# EAGLE design hybrid_lower_pcb3 (EAGLE 8.4.1)

## Sheet 1 of 8: micro,xbee,sd
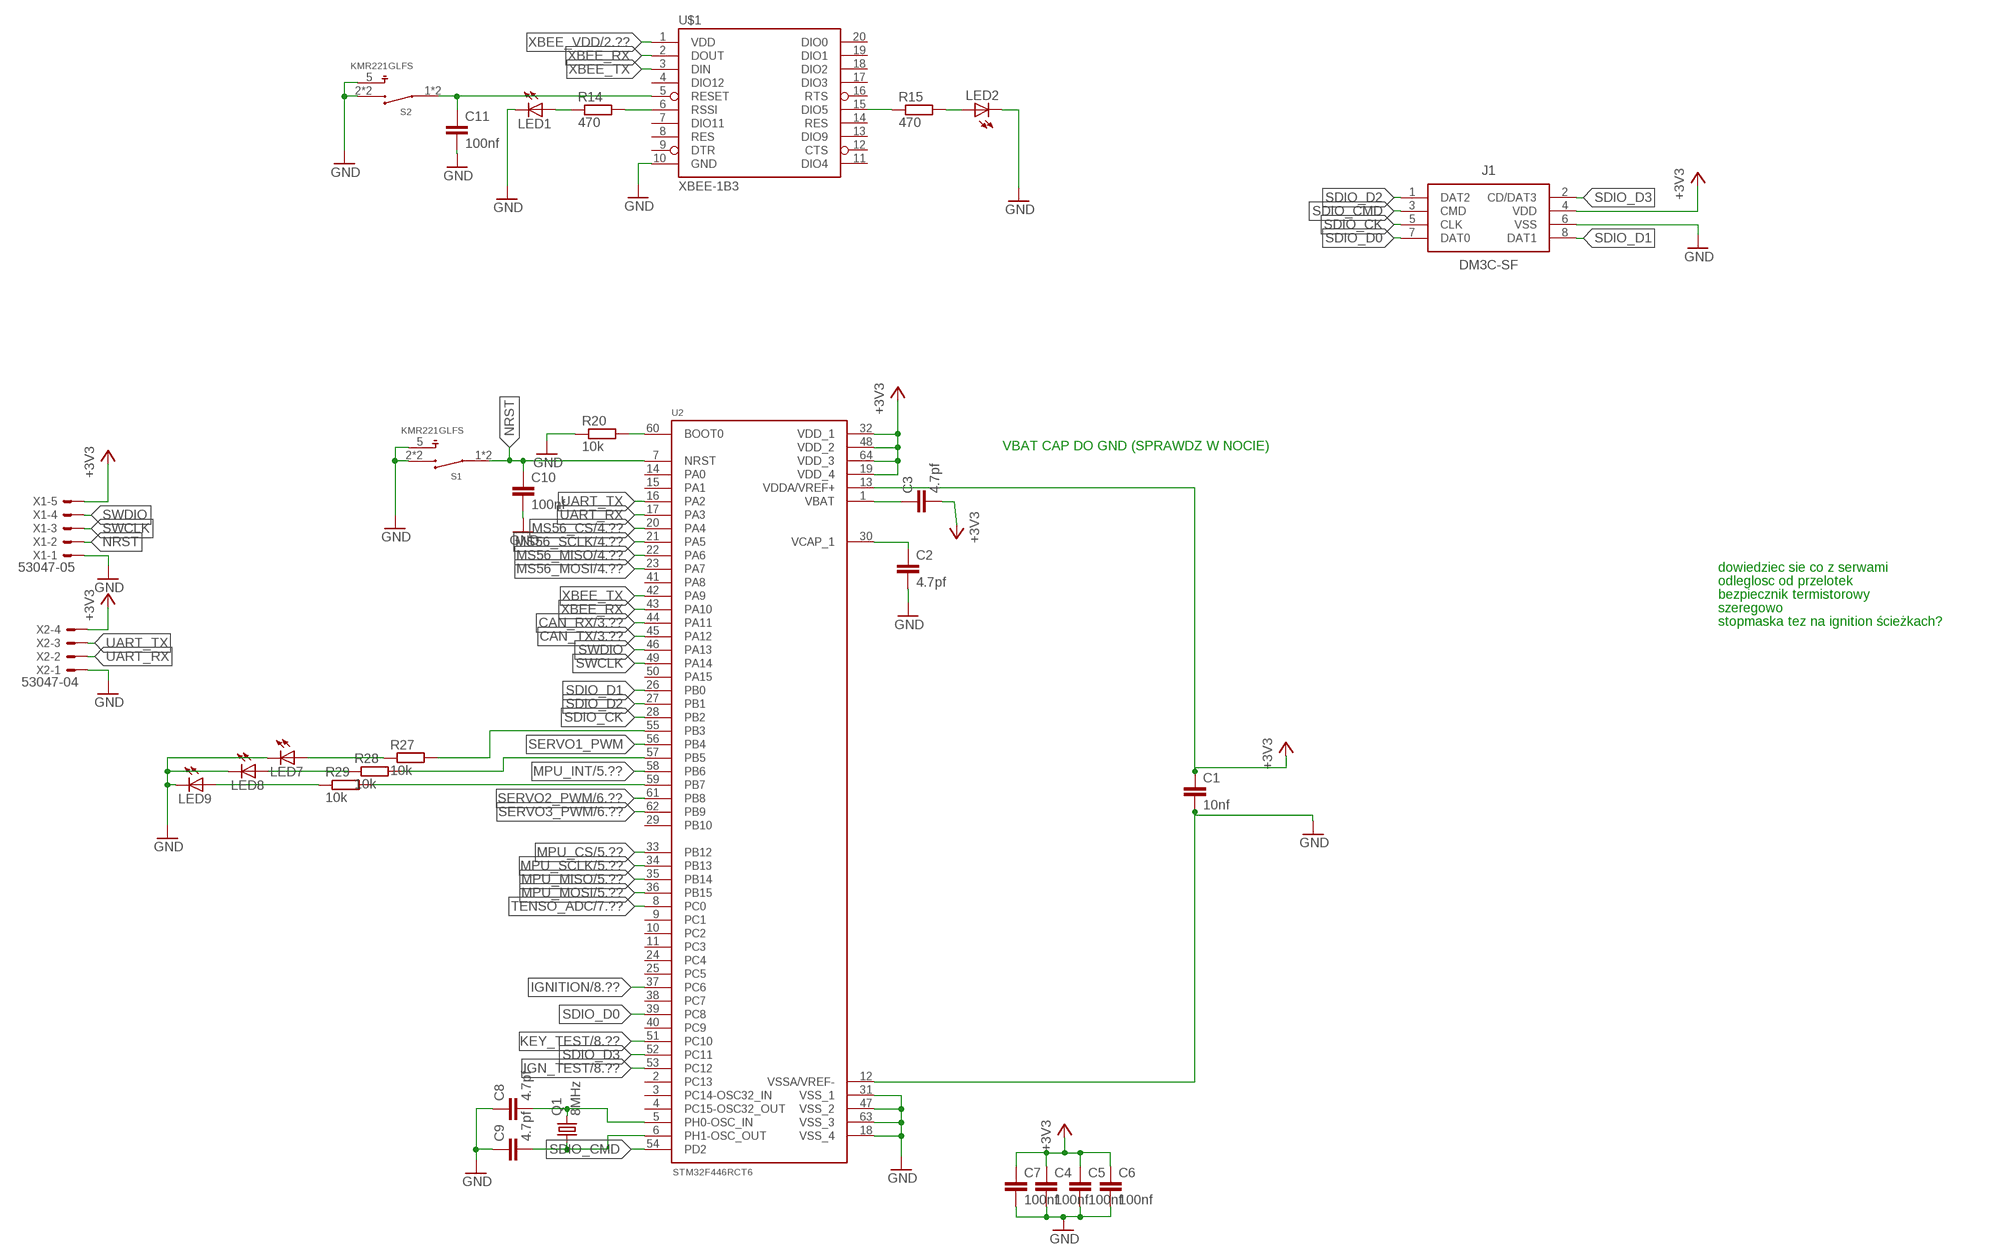
[diagram p0: schematic, sheet 1]

### Parts
C1  10nf  C-EUC0603  [C0603]
C2  4.7pf  C-EUC0603  [C0603]
C3  4.7pf  C-EUC0603  [C0603]
C4  100nf  C-EUC0603  [C0603]
C5  100nf  C-EUC0603  [C0603]
C6  100nf  C-EUC0603  [C0603]
C7  100nf  C-EUC0603  [C0603]
C8  4.7pf  C-EUC0603  [C0603]
C9  4.7pf  C-EUC0603  [C0603]
C10  100nf  C-EUC0603  [C0603]
C11  100nf  C-EUC0603  [C0603]
J1  DM3C-SF  [DM3C-SF]
LED1  LED0603  [LED-0603]
LED2  LED0603  [LED-0603]
LED7  LED0603  [LED-0603]
LED8  LED0603  [LED-0603]
LED9  LED0603  [LED-0603]
Q1  8MHz  CRYSTALCTS406  [CTS406]
R14  470  R-EU_R0603  [R0603]
R15  470  R-EU_R0603  [R0603]
R20  10k  R-EU_R0603  [R0603]
R27  10k  R-EU_R0603  [R0603]
R28  10k  R-EU_R0603  [R0603]
R29  10k  R-EU_R0603  [R0603]
S1  KMR221GLFS  [SW_KMR221GLFS]
S2  KMR221GLFS  [SW_KMR221GLFS]
U2  STM32F446RCT6  [QFP50P1200X1200X160-64N]
U$1  XBEE-1B3  [XBEE-SMD]
X1  53047-05  [53047-05]
X2  53047-04  [53047-04]

### Nets
+3V3: C1.1 C3.2 C4.1 C5.1 C6.1 C7.1 J1.4(VDD) U2.13(VDDA/VREF+) U2.19(VDD_4) U2.32(VDD_1) U2.48(VDD_2) U2.64(VDD_3) X1.5 X2.4 ; also sheet 2,3,4,5,8
CAN_RX: U2.44(PA11) ; also sheet 3
CAN_TX: U2.45(PA12) ; also sheet 3
DUPA: C11.1 S2.1 S2.4 U$1.5(RESET)
GND: C1.2 C2.2 C4.2 C5.2 C6.2 C7.2 C8.1 C9.1 C10.2 C11.2 J1.6(VSS) LED1.C LED2.C LED7.C LED8.C LED9.C R20.1 S1.2 S1.3 S1.5 S2.2 S2.3 S2.5 U2.12(VSSA/VREF-) U2.18(VSS_4) U2.31(VSS_1) U2.47(VSS_2) U2.63(VSS_3) U$1.10(GND) X1.1 X2.1 ; also sheet 2,3,4,5,6,7,8
IGN_TEST: U2.53(PC12) ; also sheet 8
IGNITION: U2.37(PC6) ; also sheet 8
KEY_TEST: U2.51(PC10) ; also sheet 8
MPU_CS: U2.33(PB12) ; also sheet 5
MPU_INT: U2.58(PB6) ; also sheet 5
MPU_MISO: U2.35(PB14) ; also sheet 5
MPU_MOSI: U2.36(PB15) ; also sheet 5
MPU_SCLK: U2.34(PB13) ; also sheet 5
MS56_CS: U2.20(PA4) ; also sheet 4
MS56_MISO: U2.22(PA6) ; also sheet 4
MS56_MOSI: U2.23(PA7) ; also sheet 4
MS56_SCLK: U2.21(PA5) ; also sheet 4
N$2: C2.1 U2.30(VCAP_1)
N$6: C3.1 U2.1(VBAT)
N$7: LED1.A R14.1
N$8: C8.2 Q1.3 U2.5(PH0-OSC_IN)
N$9: C9.2 Q1.1 U2.6(PH1-OSC_OUT)
N$11: LED2.A R15.2
N$18: R14.2 U$1.6(RSSI)
N$19: R15.1 U$1.15(DIO5)
N$29: R20.2 U2.60(BOOT0)
N$30: R27.2 U2.55(PB3)
N$33: R28.2 U2.57(PB5)
N$34: R29.2 U2.59(PB7)
N$36: LED7.A R27.1
N$37: LED8.A R28.1
N$38: LED9.A R29.1
NRST: C10.1 S1.1 S1.4 U2.7(NRST) X1.2
SDIO_CK: J1.5(CLK) U2.28(PB2)
SDIO_CMD: J1.3(CMD) U2.54(PD2)
SDIO_D0: J1.7(DAT0) U2.39(PC8)
SDIO_D1: J1.8(DAT1) U2.26(PB0)
SDIO_D2: J1.1(DAT2) U2.27(PB1)
SDIO_D3: J1.2(CD/DAT3) U2.52(PC11)
SERVO1_PWM: U2.56(PB4)
SERVO2_PWM: U2.61(PB8) ; also sheet 6
SERVO3_PWM: U2.62(PB9) ; also sheet 6
SWCLK: U2.49(PA14) X1.3
SWDIO: U2.46(PA13) X1.4
TENSO_ADC: U2.8(PC0) ; also sheet 7
UART_RX: U2.17(PA3) X2.2
UART_TX: U2.16(PA2) X2.3
XBEE_RX: U2.43(PA10) U$1.2(DOUT)
XBEE_TX: U2.42(PA9) U$1.3(DIN)
XBEE_VDD: U$1.1(VDD) ; also sheet 2
Unconnected: U2.2(PC13) U2.3(PC14-OSC32_IN) U2.4(PC15-OSC32_OUT) U2.9(PC1) U2.10(PC2) U2.11(PC3) U2.14(PA0) U2.15(PA1) U2.24(PC4) U2.25(PC5) U2.29(PB10) U2.38(PC7) U2.40(PC9) U2.41(PA8) U2.50(PA15) U$1.4(DIO12) U$1.7(DIO11) U$1.8(RES) U$1.9(DTR) U$1.11(DIO4) U$1.12(CTS) U$1.13(DIO9) U$1.14(RES) U$1.16(RTS) U$1.17(DIO3) U$1.18(DIO2) U$1.19(DIO1) U$1.20(DIO0)

### Notes on the sheet
- VBAT CAP DO GND (SPRAWDZ W NOCIE)
- dowiedziec sie co z serwami
- odleglosc od przelotek
- bezpiecznik termistorowy
- szeregowo
- stopmaska tez na ignition ścieżkach?

## Sheet 2 of 8: supply
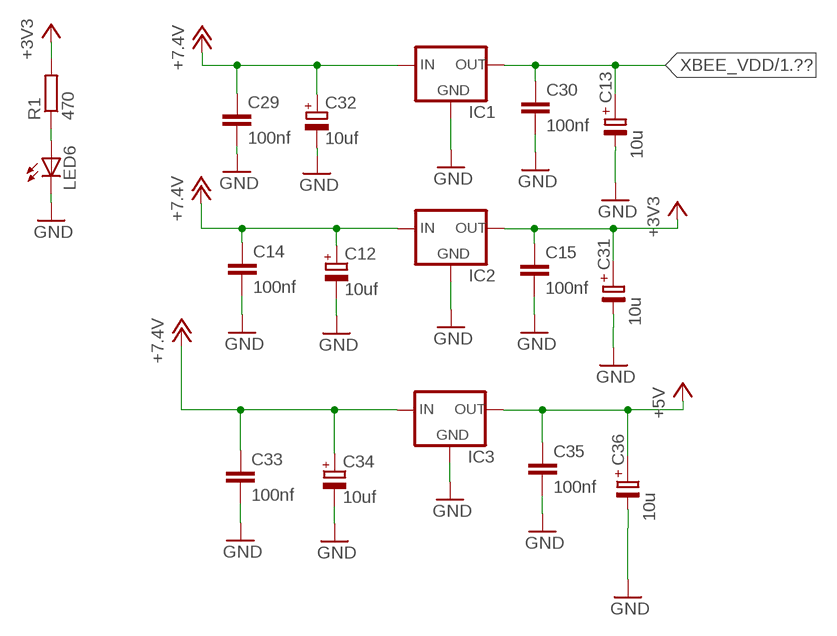
[diagram p1: schematic, sheet 2]

### Parts
C12  10uf  CPOL-EUSANYO_SMD_B6  [SANYO-OSCON_SMD_B6]
C13  10u  C-PR-SMD-TE-B  [TE-B-3528]
C14  100nf  C-EUC0603  [C0603]
C15  100nf  C-EUC0603  [C0603]
C29  100nf  C-EUC0603  [C0603]
C30  100nf  C-EUC0603  [C0603]
C31  10u  C-PR-SMD-TE-B  [TE-B-3528]
C32  10uf  CPOL-EUSANYO_SMD_B6  [SANYO-OSCON_SMD_B6]
C33  100nf  C-EUC0603  [C0603]
C34  10uf  CPOL-EUSANYO_SMD_B6  [SANYO-OSCON_SMD_B6]
C35  100nf  C-EUC0603  [C0603]
C36  10u  C-PR-SMD-TE-B  [TE-B-3528]
IC1  LM1117  [SOT223]
IC2  LM1117  [SOT223]
IC3  LM1117  [SOT223]
LED6  LED0603  [LED-0603]
R1  470  R-EU_R0603  [R0603]

### Nets
+3V3: C15.1 C31.+ IC2.2(OUT) R1.2 ; also sheet 1,3,4,5,8
+5V: C35.1 C36.+ IC3.2(OUT) ; also sheet 6,7
+12V: C12.+ C14.1 C29.1 C32.+ C33.1 C34.+ IC1.3(IN) IC2.3(IN) IC3.3(IN) ; supply symbol labelled +7.4V ; also sheet 6,8
GND: C12.- C13.- C14.2 C15.2 C29.2 C30.2 C31.- C32.- C33.2 C34.- C35.2 C36.- IC1.1(GND) IC2.1(GND) IC3.1(GND) LED6.C ; also sheet 1,3,4,5,6,7,8
N$28: LED6.A R1.1
XBEE_VDD: C13.+ C30.1 IC1.2(OUT) ; also sheet 1

## Sheet 3 of 8: CAN
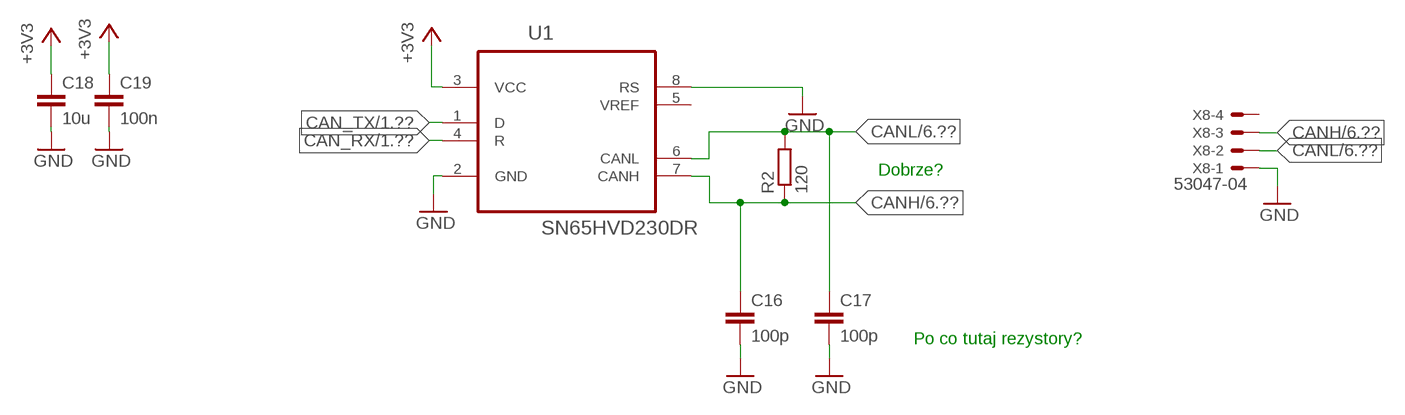
[diagram p2: schematic, sheet 3]

### Parts
C16  100p  C-EUC0603  [C0603]
C17  100p  C-EUC0603  [C0603]
C18  10u  C-EUC0603  [C0603]
C19  100n  C-EUC0603  [C0603]
R2  120  R-EU_R0603  [R0603]
U1  SN65HVD230DR  [SOIC127P600X175-8N]
X8  53047-04  [53047-04]

### Nets
+3V3: C18.1 C19.1 U1.3(VCC) ; also sheet 1,2,4,5,8
CAN_RX: U1.4(R) ; also sheet 1
CAN_TX: U1.1(D) ; also sheet 1
CANH: C16.1 R2.1 U1.7(CANH) X8.3 ; also sheet 6
CANL: C17.1 R2.2 U1.6(CANL) X8.2 ; also sheet 6
GND: C16.2 C17.2 C18.2 C19.2 U1.2(GND) U1.8(RS) X8.1 ; also sheet 1,2,4,5,6,7,8
Unconnected: U1.5(VREF) X8.4

### Notes on the sheet
- Dobrze?
- Po co tutaj rezystory?

## Sheet 4 of 8: Altimeter
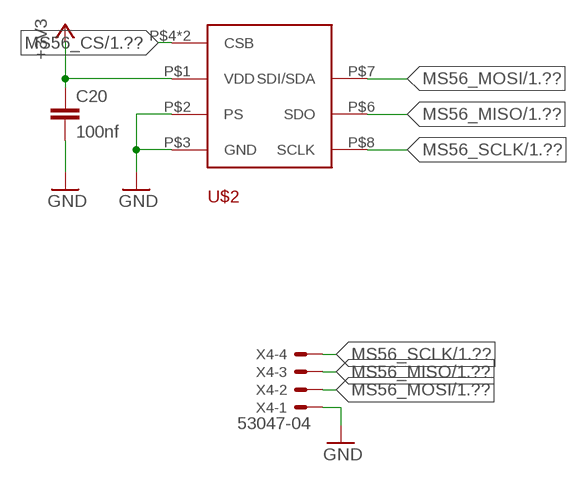
[diagram p3: schematic, sheet 4]

### Parts
C20  100nf  C-EUC0603  [C0603]
U$2  MS56XX  [MS56XX]
X4  53047-04  [53047-04]

### Nets
+3V3: C20.1 U$2.P$1(VDD) ; also sheet 1,2,3,5,8
GND: C20.2 U$2.P$2(PS) U$2.P$3(GND) X4.1 ; also sheet 1,2,3,5,6,7,8
MS56_CS: U$2.P$4(CSB) U$2.P$5(CSB) ; also sheet 1
MS56_MISO: U$2.P$6(SDO) X4.3 ; also sheet 1
MS56_MOSI: U$2.P$7(SDI/SDA) X4.2 ; also sheet 1
MS56_SCLK: U$2.P$8(SCLK) X4.4 ; also sheet 1

## Sheet 5 of 8: MPU-9250
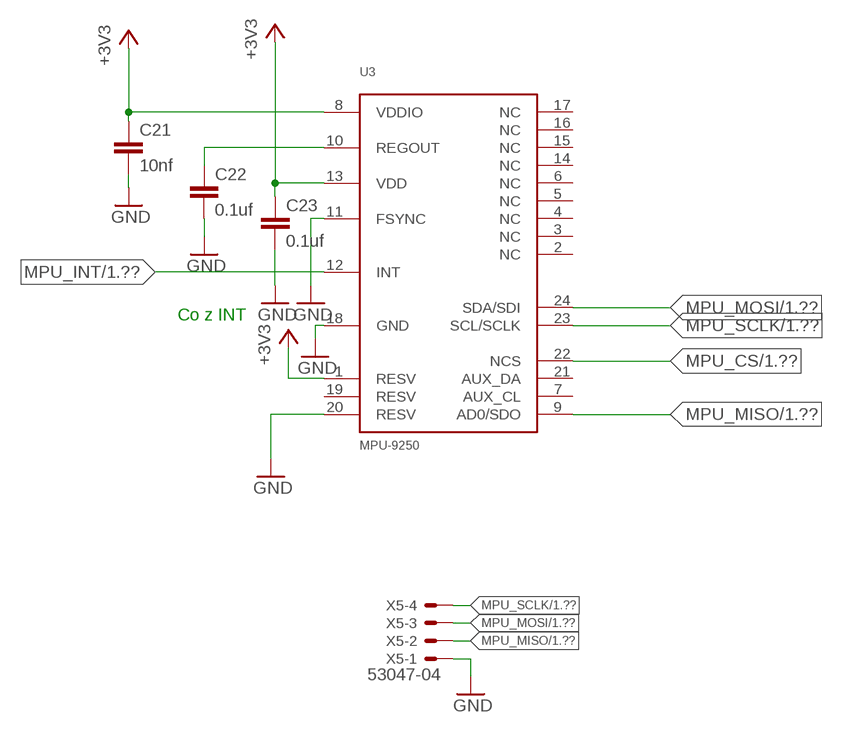
[diagram p4: schematic, sheet 5]

### Parts
C21  10nf  C-EUC0603  [C0603]
C22  0.1uf  C-EUC0603  [C0603]
C23  0.1uf  C-EUC0603  [C0603]
U3  MPU-9250  [MPU-9250]
X5  53047-04  [53047-04]

### Nets
+3V3: C21.1 C23.1 U3.1(RESV) U3.8(VDDIO) U3.13(VDD) ; also sheet 1,2,3,4,8
GND: C21.2 C22.2 C23.2 U3.11(FSYNC) U3.18(GND) U3.20(RESV) X5.1 ; also sheet 1,2,3,4,6,7,8
MPU_CS: U3.22(NCS) ; also sheet 1
MPU_INT: U3.12(INT) ; also sheet 1
MPU_MISO: U3.9(AD0/SDO) X5.2 ; also sheet 1
MPU_MOSI: U3.24(SDA/SDI) X5.3 ; also sheet 1
MPU_SCLK: U3.23(SCL/SCLK) X5.4 ; also sheet 1
N$1: C22.1 U3.10(REGOUT)
Unconnected: U3.2(NC) U3.3(NC) U3.4(NC) U3.5(NC) U3.6(NC) U3.7(AUX_CL) U3.14(NC) U3.15(NC) U3.16(NC) U3.17(NC) U3.19(RESV) U3.21(AUX_DA)

### Notes on the sheet
- Co z INT

## Sheet 6 of 8: connection
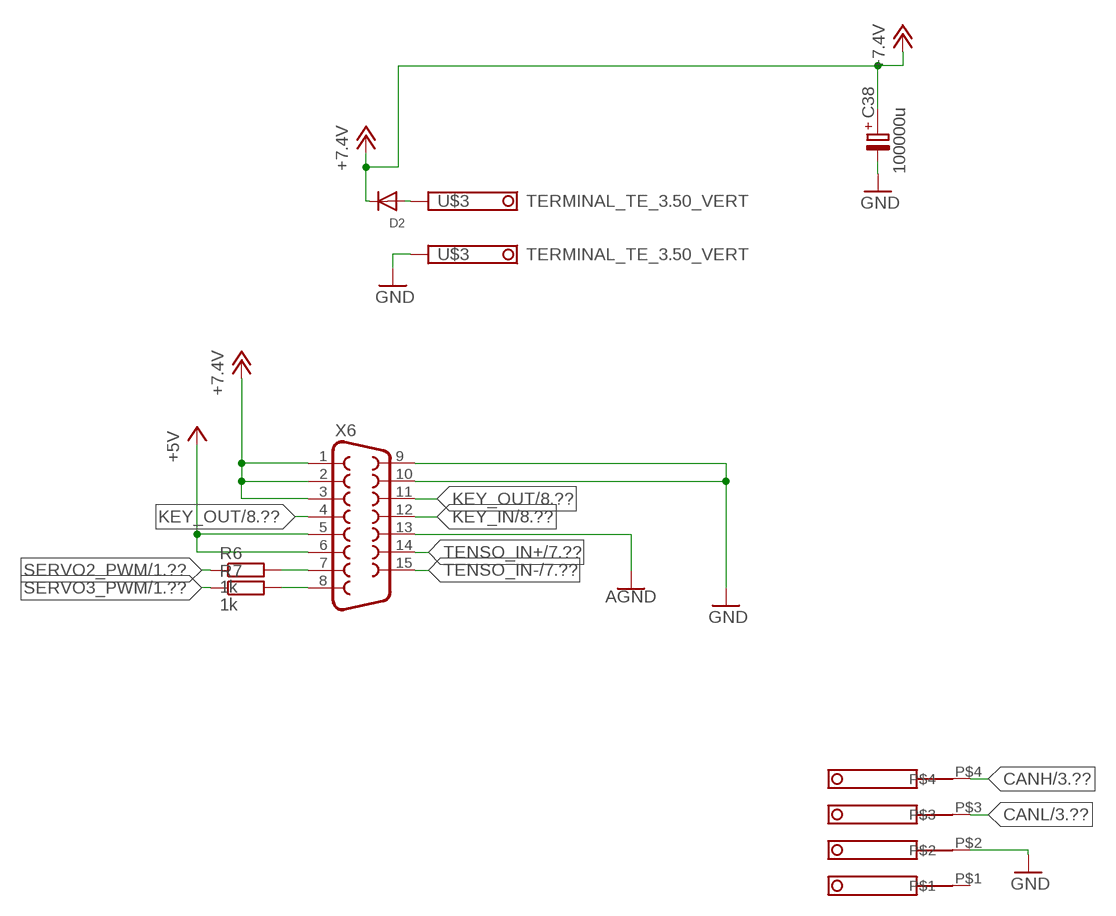
[diagram p5: schematic, sheet 6]

### Parts
C38  100000u  C-PR-SMD-TE-B  [TE-B-3528]
D2  DIODESOD-523  [SOD-523]
R6  1k  R-EU_R0603  [R0603]
R7  1k  R-EU_R0603  [R0603]
U$3  TERMINAL_TE_3.50_VERT  [TE_3.5_TERMINAL_VERT]
U$10  39505-1005  [39505-1005]
X6  F15VP  [F15VP]

### Nets
+5V: X6.5 X6.6 ; also sheet 2,7
+12V: C38.+ D2.K(C) X6.1 X6.2 X6.3 ; supply symbol labelled +7.4V ; also sheet 2,8
AGND: X6.13 ; also sheet 7
CANH: U$10.P$4 ; also sheet 3
CANL: U$10.P$3 ; also sheet 3
GND: C38.- U$3.P$2(K1) U$10.P$2 X6.9 X6.10 ; also sheet 1,2,3,4,5,7,8
KEY_IN: X6.12 ; also sheet 8
KEY_OUT: X6.4 X6.11 ; also sheet 8
N$13: R6.2 X6.7
N$14: R7.2 X6.8
N$17: D2.A U$3.P$1(K)
SERVO2_PWM: R6.1 ; also sheet 1
SERVO3_PWM: R7.1 ; also sheet 1
TENSO_IN+: X6.14 ; also sheet 7
TENSO_IN-: X6.15 ; also sheet 7
Unconnected: U$10.P$1

## Sheet 7 of 8
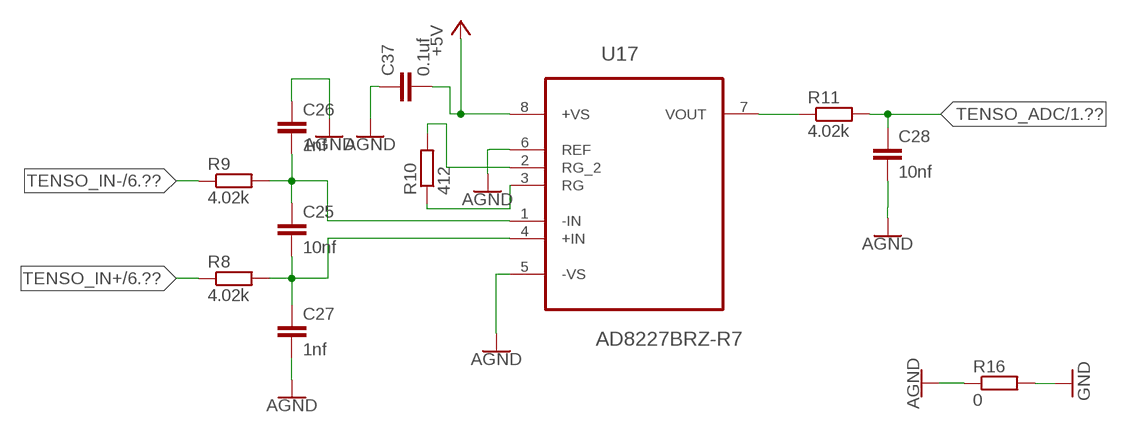
[diagram p6: schematic, sheet 7]

### Parts
C25  10nf  C-EUC0603  [C0603]
C26  1nf  C-EUC0603  [C0603]
C27  1nf  C-EUC0603  [C0603]
C28  10nf  C-EUC0603  [C0603]
C37  0.1uf  C-EUC0603  [C0603]
R8  4.02k  R-EU_R0603  [R0603]
R9  4.02k  R-EU_R0603  [R0603]
R10  412  R-EU_R0805  [R0805]
R11  4.02k  R-EU_R0603  [R0603]
R16  0  R-EU_R0603  [R0603]
U17  AD8227BRZ-R7  [SOIC127P600X175-8N]

### Nets
+5V: C37.2 U17.8(+VS) ; also sheet 2,6
AGND: C26.1 C27.2 C28.2 C37.1 R16.1 U17.5(-VS) U17.6(REF) ; also sheet 6
GND: R16.2 ; also sheet 1,2,3,4,5,6,8
N$3: C25.1 C26.2 R9.2 U17.1(-IN)
N$4: C25.2 C27.1 R8.2 U17.4(+IN)
N$10: R10.1 U17.3(RG)
N$15: R10.2 U17.2(RG_2)
N$16: R11.1 U17.7(VOUT)
TENSO_ADC: C28.1 R11.2 ; also sheet 1
TENSO_IN+: R8.1 ; also sheet 6
TENSO_IN-: R9.1 ; also sheet 6

## Sheet 8 of 8: Ignition
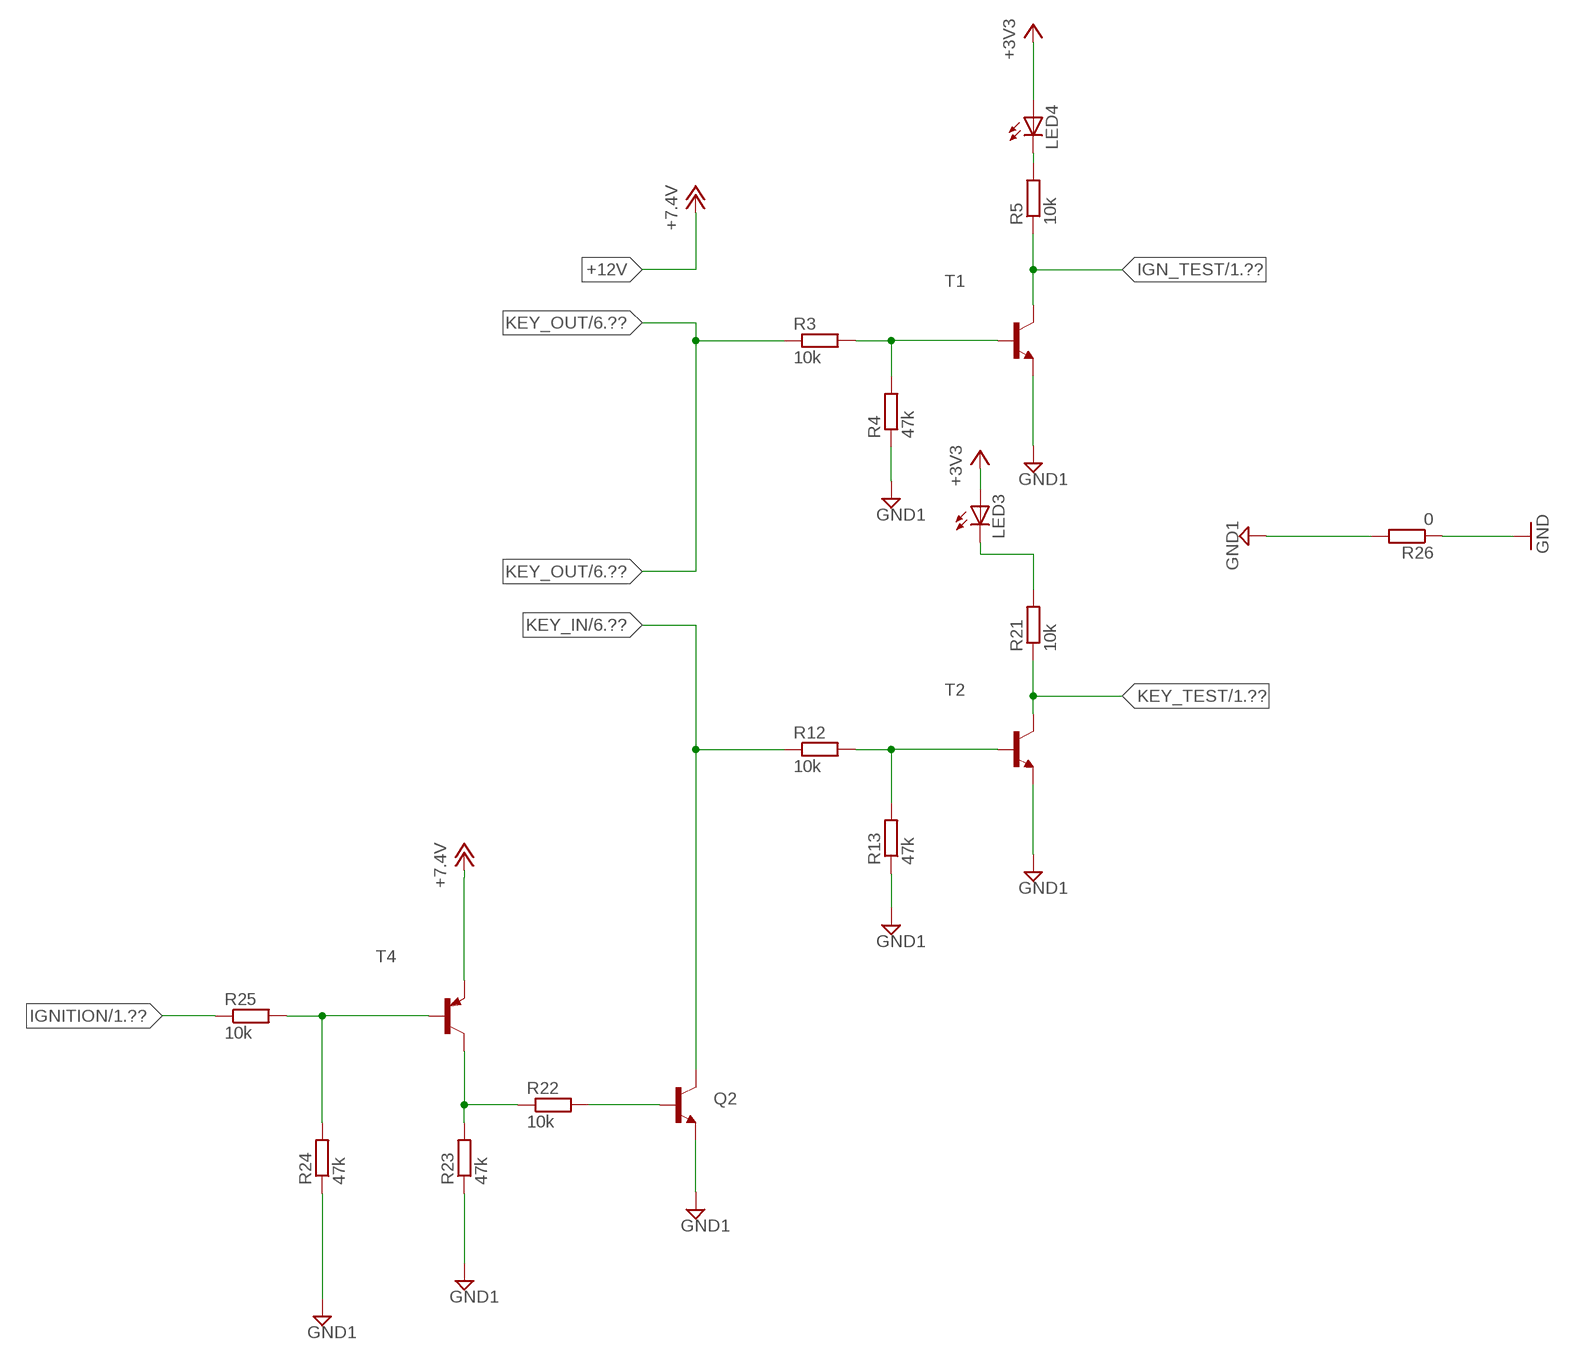
[diagram p7: schematic, sheet 8]

### Parts
LED3  LED0603  [LED-0603]
LED4  LED0603  [LED-0603]
Q2  TRANSISTOR_NPNSOT23-3  [SOT23-3]
R3  10k  R-EU_R0603  [R0603]
R4  47k  R-EU_R0603  [R0603]
R5  10k  R-EU_R0603  [R0603]
R12  10k  R-EU_R0603  [R0603]
R13  47k  R-EU_R0603  [R0603]
R21  10k  R-EU_R0603  [R0603]
R22  10k  R-EU_R0603  [R0603]
R23  47k  R-EU_R0603  [R0603]
R24  47k  R-EU_R0603  [R0603]
R25  10k  R-EU_R0603  [R0603]
R26  0  R-EU_R0603  [R0603]
T1  BCW81-NPN-SOT23-BEC  [SOT23-BEC]
T2  BCW81-NPN-SOT23-BEC  [SOT23-BEC]
T4  BC807-16-PNP-SOT23-BEC  [SOT23-BEC]

### Nets
+3V3: LED3.A LED4.A ; also sheet 1,2,3,4,5
+12V: T4.E ; supply symbol labelled +7.4V ; also sheet 2,6
GND: R26.1 ; also sheet 1,2,3,4,5,6,7
GND1: Q2.2(E) R4.1 R13.1 R23.1 R24.1 R26.2 T1.E T2.E
IGN_TEST: R5.1 T1.C ; also sheet 1
IGNITION: R25.1 ; also sheet 1
KEY_IN: Q2.3(C) R12.1 ; also sheet 6
KEY_OUT: R3.1 ; also sheet 6
KEY_TEST: R21.1 T2.C ; also sheet 1
N$5: R3.2 R4.2 T1.B
N$12: R12.2 R13.2 T2.B
N$20: LED4.C R5.2
N$21: LED3.C R21.2
N$31: Q2.1(B) R22.2
N$32: R22.1 R23.2 T4.C
N$35: R24.2 R25.2 T4.B

## Library data of the parts
C1-C11 C14-C19 C21-C23 C25-C30 C33 C35 C37 = rcl:C-EU: CAPACITOR, European symbol; SPICEPREFIX: C
C12 C32 C34 = rcl:CPOL-EU: POLARIZED CAPACITOR, European symbol; SPICEPREFIX: C
C13 C31 C36 C38 = capacitors:C-PR: POLARIZED ELECTROLYTIC/TANTALUM
C20 = resistor:C-EU: CAPACITOR, European symbol
D2 = adafruit:DIODE: Diode SMADIODE - SMA Surface Mount Package 20V 1A Schottky Diode Digikey: 641-1014-6-ND DO-1N4148 - Through Hole Small Current Diode SOD-123 20V 1 A (.5mV Vf) Schottky Diode - Digikey: MBRX120TPMSCT-ND SOD-323 10V 570mA (.38mV Vf, 3ns) Schottky Diode - Digikey: ZLLS410CT-ND SOD-523 30V 30mA Schottky Diode (RB751S-40TE61) - Digikey: RB751S-40TE61CT-ND SOT23-R/W - SOT23 Package (R = Solder Paste/Reflow Ovens, W = Hand-Soldering) BAT54Film 40V 300mA - Digikey: 497-7162-1-ND
IC1-IC3 = v-reg-3:LM1117
J1 = DM3C-SF:DM3C-SF: Micro SD card hinge version Micro SD card hinge version <https://componentsearchengine.com/Images/1/DM3C-SF.jpg> Source: Datasheet <https://www.hirose.com/product/en/download_file/key_name/DM3/category/Catalog/doc_file_id/49662/?file_category_id=4&item_id=195&is_series=1>; DESCRIPTION: Micro SD card hinge version Micro SD card hinge version; DIGIKEY_PART_NUMBER: HR1940TR-ND; HEIGHT: mm; MANUFACTURER_NAME: Hirose; MANUFACTURER_PART_NUMBER: DM3C-SF; SUPPLIER_NAME: DigiKey
LED1-LED4 LED6-LED9 = SparkFun:LED: LEDs Standard schematic elements and footprints for 5mm, 3mm, 1206, and 0603 sized LEDs. 5mm - Spark Fun Electronics SKU : COM-00529 (and others)
Q1 = crystal:CRYSTAL: CRYSTAL; OC_FARNELL: unknown; OC_NEWARK: unknown
Q2 = SparkFun:TRANSISTOR_NPN: Transistor NPN BJT configuration in SOT23 package. MMBT2222 is the common NPN we use. Double check BCE configuration again layout.
R1 R16 R20 R27-R29 = resistor:R-EU_: RESISTOR, European symbol
R2-R15 R21-R26 = rcl:R-EU_: RESISTOR, European symbol; SPICEPREFIX: R
S1 S2 = KMR221GLFS:KMR221GLFS: Switch Tactile N.O. SPST Button Gull Wing 0.05A 32VDC 1VA 200000Cycles 2N SMD Automotive T/R; AVAILABILITY: Good; DESCRIPTION: Switch Tactile N.O. SPST Button Gull Wing 0.05A 32VDC 1VA 200000Cycles 2N SMD Automotive T/R; MF: C&K Components; MP: KMR221GLFS; PACKAGE: None; PRICE: 0.28 USD
T1 T2 = DC_LOAD_AU:*-NPN-: NPN Transistror BF959 corrected 2008.03.06
T4 = DC_LOAD_AU:*-PNP-: PNP Transistror
U1 = SN65HVD230DR:SN65HVD230DR: 3.3-V CAN TRANSCEIVERS; AVAILABILITY: Good; DESCRIPTION: 3.3V CAN Transceiver with Standby Mode 8-SOIC -40 to 85; MF: Texas Instruments; MP: SN65HVD230DR; PACKAGE: SOIC-8 Texas Instruments; PRICE: 1.59 USD
U2 = STM32F446RCT6:STM32F446RCT6: 32 Bit Microcontroller, High Performance, ARM Cortex-M4, 180 MHz, 256 KB, 128 KB, 64, LQFP; AVAILABILITY: Good; DESCRIPTION: 32 Bit Microcontroller, High Performance, ARM Cortex-M4, 180 MHz, 256 KB, 128 KB, 64, LQFP; MF: STMicroelectronics; MP: STM32F446RCT6; PACKAGE: LQFP-64 STMicroelectronics; PRICE: 5.57 USD
U3 = MPU-9250:MPU-9250: 314990005; AVAILABILITY: Good; DESCRIPTION: SMD Gyroscope/Accelerometer/Magnetometer Sensor; 9-AXIS; MF: InvenSense; MP: MPU-9250; PACKAGE: QFN-24 InvenSense; PRICE: 6.45 USD
U17 = Analog Devices_By_element14_Batch_1:AD8227BRZ-R7: Wide Supply Range, Rail-to-Rail Output Instrumentation Amplifier; MPN: AD8227BRZ-R7; OC_FARNELL: -; OC_NEWARK: 14R8723; PACKAGE: SOIC-8; SUPPLIER: Analog Devices
U$1 = SparkFun:XBEE-1
U$2 = MS56XX:MS56XX
U$3 = Terminal_TE_3.50:TERMINAL_TE_3.50_VERT
U$10 = 39505-1005:39505-1005
X1 = con-molex:53?-05: CONNECTOR wire to board 1.25 mm (.049 inch) pitch header; MF: MOLEX; MPN: 53047-0510; OC_FARNELL: 9732861; OC_NEWARK: 38C9901
X2 X4 X5 X8 = con-molex:53?-04: CONNECTOR wire to board 1.25 mm (.049 inch) pitch header; MF: WALDOM/MOLEX; MPN: 53047-0410; OC_FARNELL: 9733060; OC_NEWARK: 38C9900
X6 = adafruit:F15: SUB-D HDH is also known as a 'right angle VGA' connector

## Board
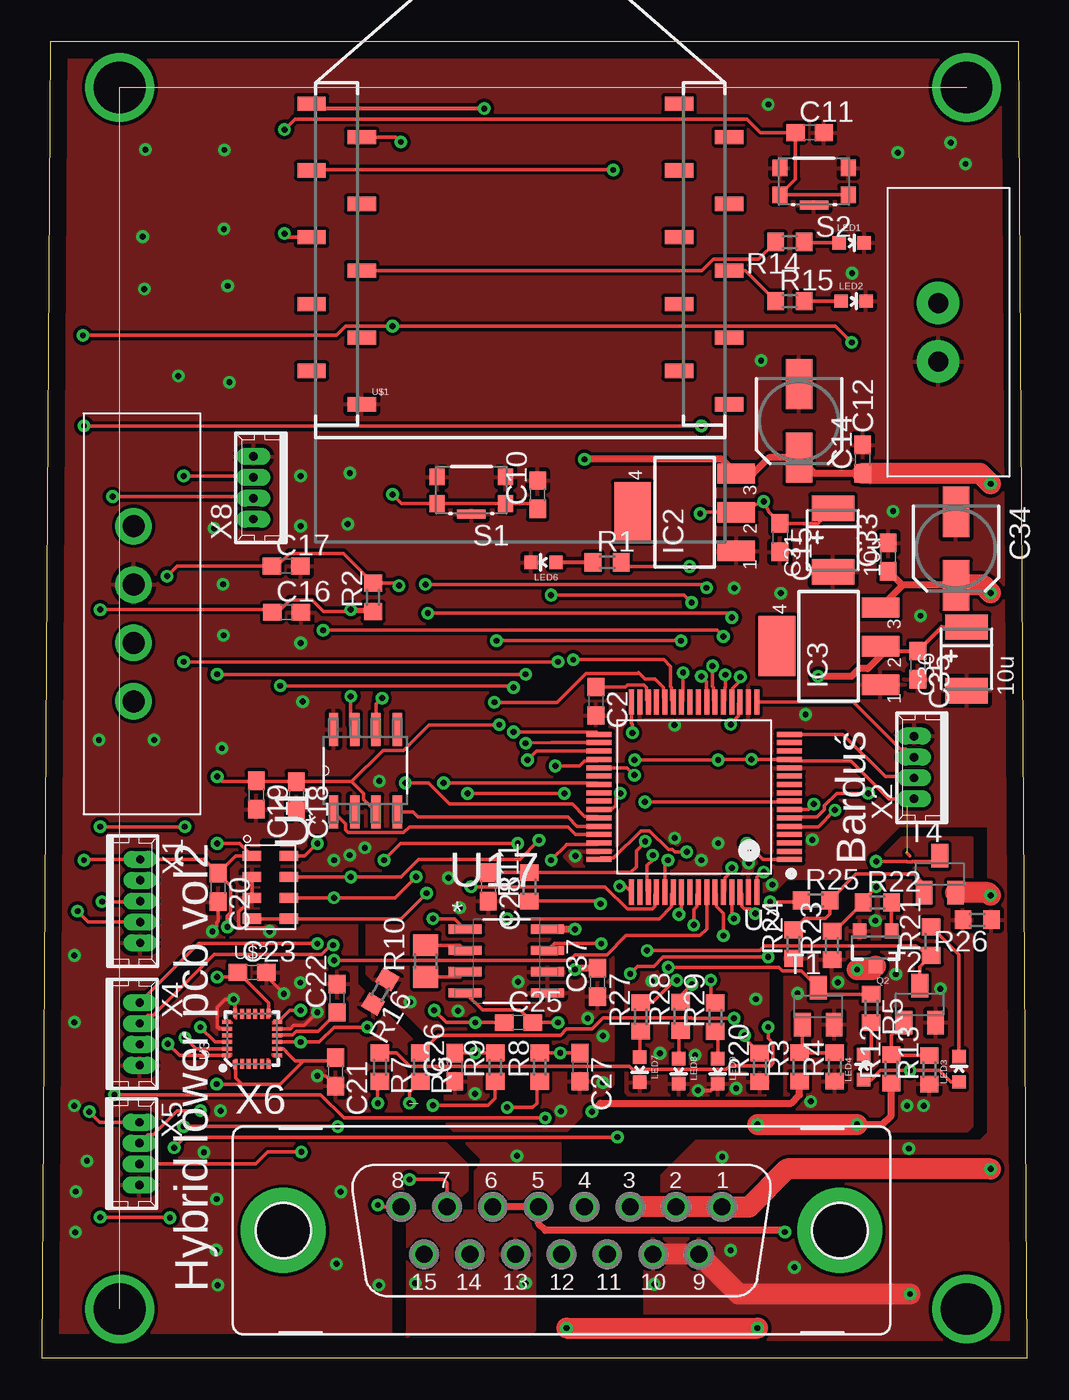
[diagram p8: board, top side]
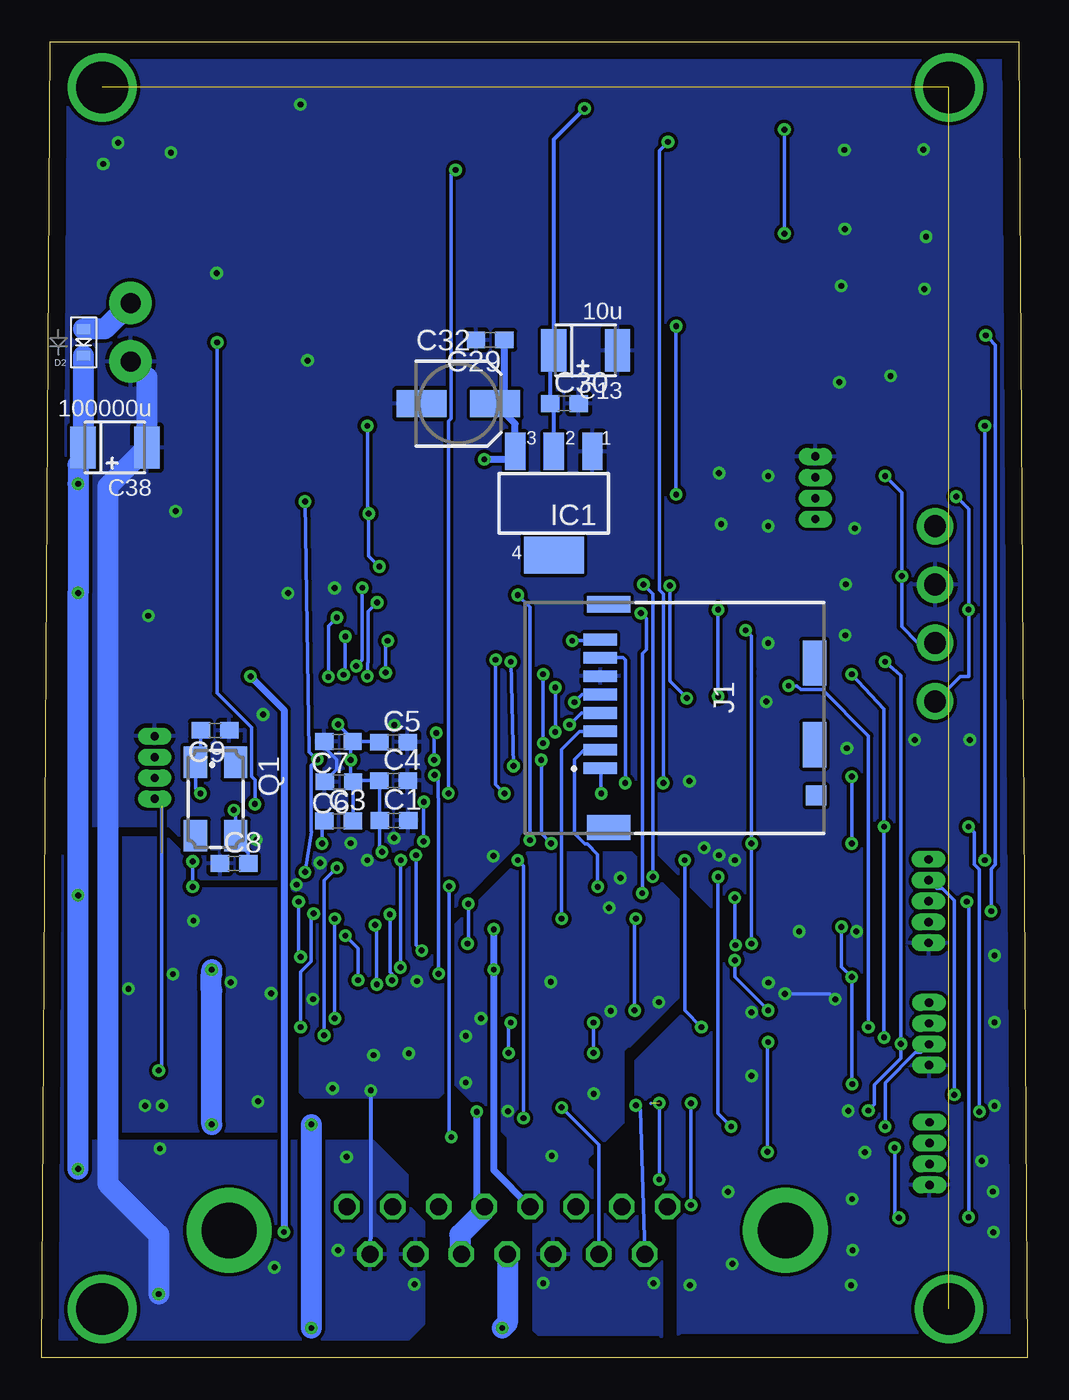
[diagram p9: board, bottom side, seen from below]

Size 59 x 78.79 mm. Coordinates in mm from the lower left corner, seen from the top.
Outline: 0,0 59,0 58.5,78.79 0.5,78.79 0,0
Copper layers (1*16): Top 0.035mm / dielectric 1.5mm / Bottom 0.035mm
Design rules "default *": minimum track width 6mil, minimum drill 0.35mm, track to track 6mil, track to pad 6mil, pad to pad 6mil, via to via 6mil, smd to smd 6mil, copper to edge 40mil, drill to drill 6mil, minimum pad ring 10mil, minimum via ring 8mil, stop-mask expansion 4mil, vias tented up to drill 15mil, thermal gap 10mil
tRestrict: area 13.3,26.8 to 14.1,30.9

### Footprints (pad centres in the part's own frame; a part is rotated, then mirrored left to right if it is on the bottom)
C0603 = smd 1.1 x 1: 1 -0.85,0; 2 0.85,0
SANYO-OSCON_SMD_B6 = smd 3 x 1.6: + 2.2,0; - -2.2,0
TE-B-3528 = smd 1.524 x 2.54: + 1.905,0; - -1.905,0
SOD-523 = smd 0.8 x 0.6: A 0,-0.8; K 0,0.8
SOT223 = smd 1.219 x 2.235: 1 -2.311,-3.099; 2 0,-3.099; 3 2.311,-3.099 | smd 3.6 x 2.2: 4 0,3.099
DM3C-SF = smd 0.7 x 2: 1 3,0; 2 1.9,0; 3 0.8,0; 4 -0.3,0; 5 -1.4,0; 6 -2.5,0; 7 -3.6,0; 8 -4.7,0 | smd 1 x 2.6: 9 -6.8,0.5 | smd 2.7 x 1.4: 10 -3.3,12.827; 11 1.6,12.827 | smd 1.2 x 1.2: 12 4.65,12.927 | smd 1.5 x 2.6: 13 6.55,0.5
LED-0603 = smd 0.8 x 0.8: A 0,-0.75; C 0,0.75
CTS406 = smd 1.9 x 1.4: 1 -2.2,-1.2; 2 2.2,-1.2; 3 2.2,1.2; 4 -2.2,1.2
SOT23-3 = smd 0.8 x 0.9: 1 -0.95,-1; 2 0.95,-1; 3 0,1.1
R0603 = smd 1 x 1.1: 1 -0.85,0; 2 0.85,0
R0805 = smd 1.3 x 1.5: 1 -0.95,0; 2 0.95,0
SW_KMR221GLFS = smd 0.9 x 1: 1 -2.05,0.8; 2 -2.05,-0.8; 3 2.05,-0.8; 4 2.05,0.8 | smd 1.7 x 0.55: 5 0,1.425
SOT23-BEC = smd 1 x 1.4: B -0.95,-1.1; C 0,1.1; E 0.95,-1.1
SOIC127P600X175-8N = smd 1.981 x 0.559: 1 -2.464,1.905; 2 -2.464,0.635; 3 -2.464,-0.635; 4 -2.464,-1.905; 5 2.464,-1.905; 6 2.464,-0.635; 7 2.464,0.635; 8 2.464,1.905
QFP50P1200X1200X160-64N = smd 1.5 x 0.3: 1 -5.7,3.75; 2 -5.7,3.25; 3 -5.7,2.75; 4 -5.7,2.25; 5 -5.7,1.75; 6 -5.7,1.25; 7 -5.7,0.75; 8 -5.7,0.25; 9 -5.7,-0.25; 10 -5.7,-0.75; 11 -5.7,-1.25; 12 -5.7,-1.75; 13 -5.7,-2.25; 14 -5.7,-2.75; 15 -5.7,-3.25; 16 -5.7,-3.75; 33 5.7,-3.75; 34 5.7,-3.25; 35 5.7,-2.75; 36 5.7,-2.25; 37 5.7,-1.75; 38 5.7,-1.25; 39 5.7,-0.75; 40 5.7,-0.25; 41 5.7,0.25; 42 5.7,0.75; 43 5.7,1.25; 44 5.7,1.75; 45 5.7,2.25; 46 5.7,2.75; 47 5.7,3.25; 48 5.7,3.75 | smd 0.3 x 1.5: 17 -3.75,-5.7; 18 -3.25,-5.7; 19 -2.75,-5.7; 20 -2.25,-5.7; 21 -1.75,-5.7; 22 -1.25,-5.7; 23 -0.75,-5.7; 24 -0.25,-5.7; 25 0.25,-5.7; 26 0.75,-5.7; 27 1.25,-5.7; 28 1.75,-5.7; 29 2.25,-5.7; 30 2.75,-5.7; 31 3.25,-5.7; 32 3.75,-5.7; 49 3.75,5.7; 50 3.25,5.7; 51 2.75,5.7; 52 2.25,5.7; 53 1.75,5.7; 54 1.25,5.7; 55 0.75,5.7; 56 0.25,5.7; 57 -0.25,5.7; 58 -0.75,5.7; 59 -1.25,5.7; 60 -1.75,5.7; 61 -2.25,5.7; 62 -2.75,5.7; 63 -3.25,5.7; 64 -3.75,5.7
MPU-9250 = smd 0.495 x 0.25: 1 -1.552,1; 6 -1.552,-1; 13 1.552,-1; 18 1.552,1 | smd 0.6 x 0.24: 2 -1.5,0.6; 3 -1.5,0.2; 4 -1.5,-0.2; 5 -1.5,-0.6; 14 1.5,-0.6; 15 1.5,-0.2; 16 1.5,0.2; 17 1.5,0.6 | smd 0.25 x 0.495: 7 -1,-1.552; 12 1,-1.552; 19 1,1.552; 24 -1,1.552 | smd 0.24 x 0.6: 8 -0.6,-1.5; 9 -0.2,-1.5; 10 0.2,-1.5; 11 0.6,-1.5; 20 0.6,1.5; 21 0.2,1.5; 22 -0.2,1.5; 23 -0.6,1.5
XBEE-SMD = smd 1.7 x 0.85: 1 -12.5,20; 2 -9.5,18; 3 -12.5,16; 4 -9.5,14; 5 -12.5,12; 6 -9.5,10; 7 -12.5,8; 8 -9.5,6; 9 -12.5,4; 10 -9.5,2; 11 12.5,2; 12 9.5,4; 13 12.5,6; 14 9.5,8; 15 12.5,10; 16 9.5,12; 17 12.5,14; 18 9.5,16; 19 12.5,18; 20 9.5,20
MS56XX = smd 1.1 x 0.6: P$1 -1.1,1.875; P$2 -1.1,0.625; P$3 -1.1,-0.625; P$4 -1.1,-1.875; P$5 1.1,-1.875; P$6 1.1,-0.625; P$7 1.1,0.625; P$8 1.1,1.875
TE_3.5_TERMINAL_VERT = drill 1.2 pad 2.54: P$1 1.75,-3; P$2 -1.75,-3
39505-1005 = drill 1.3 pad 2.184: P$1 -27,6; P$2 -23.5,6; P$3 -20,6; P$4 -16.5,6
53047-05 = drill 0.5 pad 0.698 long: 1 2.5,0.45; 2 1.25,0.45; 3 0,0.45; 4 -1.25,0.45; 5 -2.5,0.45
53047-04 = drill 0.5 pad 0.698 long: 1 1.875,0.45; 2 0.625,0.45; 3 -0.625,0.45; 4 -1.875,0.45
F15VP = drill 1.016 octagon: 1 9.601,1.422; 2 6.858,1.422; 3 4.115,1.422; 4 1.372,1.422; 5 -1.372,1.422; 6 -4.115,1.422; 7 -6.858,1.422; 8 -9.601,1.422; 9 8.23,-1.422; 10 5.486,-1.422; 11 2.743,-1.422; 12 0,-1.422; 13 -2.743,-1.422; 14 -5.486,-1.422; 15 -8.23,-1.422 | drill 3.302 pad 5.08: G1 -16.662,0; G2 16.662,0

### Placement (x,y rotation side)
C1  37.91,32.17 0 bottom
C2  33.19,39.31 270 top
C3  41.22,32.14 0 bottom
C4  37.93,34.55 0 bottom
C5  37.93,36.85 0 bottom
C6  41.2,34.49 180 bottom
C7  41.23,36.89 180 bottom
C8  47.48,29.6 0 bottom
C9  48.62,37.57 180 bottom
C10  29.69,51.67 90 top
C11  45.99,73.35 0 top
C12  45.35,56.09 270 top
C13  26.43,60.31 180 bottom
C14  49.16,53.8 90 top
C15  44.2,49.1 270 top
C16  14.67,44.63 0 top
C17  14.64,47.4 0 top
C18  15.25,33.65 270 top
C19  12.85,33.69 270 top
C20  10.56,28.15 270 top
C21  17.59,17.12 270 top
C22  17.69,21.53 90 top
C23  12.61,23.07 0 top
C25  28.55,20.07 0 top
C26  24.74,17.4 90 top
C27  32.23,17.4 270 top
C28  26.74,28.19 270 top
C29  32.14,60.94 180 bottom
C30  27.7,57.13 0 bottom
C31  47.38,48.96 90 top
C32  34.05,57.13 0 bottom
C33  50.68,47.94 90 top
C34  54.74,48.45 270 top
C35  52.46,41.47 270 top
C36  55.38,41.85 90 top
C37  33.28,22.48 90 top
C38  54.62,54.49 180 bottom
D2  56.5,60.79 180 bottom
IC1  28.34,51.16 180 bottom
IC2  38.49,50.63 90 top
IC3  47.12,42.61 90 top
J1  25.56,38.31 270 bottom
LED1  48.5,66.76 270 top
LED2  48.61,63.26 270 top
LED3  54.92,17.27 0 top
LED4  49.2,17.4 0 top
LED6  30.05,47.62 90 top
LED7  35.81,17.24 180 top
LED8  38.14,17.16 180 top
LED9  40.48,17.16 180 top
Q1  48.59,33.46 270 bottom
Q2  49.93,24.56 180 top
R1  33.86,47.62 0 top
R2  19.84,45.53 90 top
R3  45.37,17.41 90 top
R4  47.48,17.41 90 top
R5  49.67,20.92 270 top
R6  22.66,17.4 270 top
R7  20.25,17.4 270 top
R8  29.82,17.4 90 top
R9  27.15,17.4 90 top
R10  23,23.75 90 top
R11  29.2,28.19 90 top
R12  50.87,17.3 90 top
R13  53.15,17.24 90 top
R14  44.8,66.8 180 top
R15  44.8,63.26 0 top
R16  20.27,21.92 240 top
R20  42.99,17.38 90 top
R21  53.26,24.94 90 top
R22  50.04,27.26 0 top
R23  47.32,24.69 90 top
R24  45.01,24.77 90 top
R25  46.34,27.39 0 top
R26  56.02,26.22 180 top
R27  35.86,20.41 90 top
R28  38.25,20.44 90 top
R29  40.33,20.4 90 top
S1  25.72,51.94 180 top
S2  46.24,70.43 180 top
T1  46.5,21.05 0 top
T2  52.58,21.17 0 top
T4  53.78,28.96 0 top
U1  19.38,35.15 90 top
U2  39.07,33.57 180 top
U3  12.59,19.1 90 top
U17  27.82,23.75 0 top
U$1  28.66,55.09 0 top
U$2  13.69,28.16 0 top
U$3  50.68,61.4 90 top
U$10  -0.5,22.79 270 top
U$15  [LOGO]  19.07,44.18 0 top
X1  5.44,27.34 270 top
X2  52.69,35.34 90 top
X4  5.42,19.39 270 top
X5  5.39,12.22 270 top
X6  31.12,7.62 0 top
X8  13.12,52.09 90 top

### Tracks (layer width: path | path; a pad name or v marks a point on that pad's centre or on a via)
+3V3  (via drill 0.35)  (2 unrouted)
  Top 0.203: U2.19 41.72,39.18 41.72,38.42 41.26,37.96 v41.26,37.92 | U2.64 42.82,28.79 v43.23,29.08 | X2.4 50.72,33.46 48.46,35.73 44.86,35.73 U2.13 v42.5,35.82 40.53,35.82 v40.5,35.79 v35.5,35.79 | C20.1 11.6,30.04 U$2.P$1 11.84,30.79 v10.5,30.79 | C31.+ 46.47,49.95 C15.1 43.53,50.63 v43.23,51.26 IC2.2 39.51,50.63 v39.42,50.55 | U3.8 14.47,18.5 14.64,18.33 14.64,18.3 15.17,17.78 15.68,17.78 | C21.1 17.4,17.78 15.68,17.78 | U3.13 13.59,21.24 C23.1 11.48,22.79 v10.5,22.79 | C19.1 12.89,34.5 | 12.89,34.5 C18.1 18.56,34.5 | U1.3 19.27,33.42 19.27,33.78 18.56,34.5 | v38.79,47.37 34.96,47.37 R1.2 | U2.32 35.32,37.98 35.37,37.92 v35.37,37.41 | U2.48 33.46,29.92 34.24,29.92 35.87,31.55 36.4,31.55 37.52,30.43 37.76,30.43 37.9,30.29 v38.63,30.29 | C20.1 9.73,29.84 X1.5 2.57,29.84 v2.53,29.79 | v10.5,34.79 10.8,34.5 12.89,34.5 | v2.53,55.79 v39.5,55.79 | 18.56,34.5 20.43,36.37 21.67,36.37 23.2,37.9 v27.4,37.9 | U3.1 11.61,17.53 11.61,16.76 11.99,16.38 | 11.99,16.38 14.28,16.38 15.68,17.78 | v11.11,25.79 11.11,26.45 11.32,26.65 11.32,28.25 C20.1 | v10.47,16.38 11.99,16.38 | LED3.A 54.43,16.52 53.75,17.2 v52,17.2 50.22,17.2 49.66,16.65 LED4.A | 51.81,30.23 51.98,30.06
  Bottom 0.203: C5.1 38.82,36.89 C7.1 | C6.1 40.29,34.55 C4.1 38.76,34.53 C1.1 38.76,30.42 v38.63,30.29 | C6.1 40.35,32.15 C3.2 | C7.1 40.5,36.78 v40.5,35.79 40.5,34.63 C6.1 | v43.23,29.08 42.85,31.52 42.87,31.54 42.87,35.45 42.52,35.81 | 42.52,35.81 v42.5,35.82 | v38.79,47.37 39.42,48.01 v39.42,50.55 39.5,50.62 v39.5,55.79 | v10.5,30.79 v10.5,34.79 | v43.23,51.26 42.98,36.27 42.52,35.81 | v2.53,55.79 v2.53,29.79 | J1.4 26.69,38.61 v27.4,37.9 | v11.11,25.79 11.11,23.41 v10.5,22.79 10.5,16.41 v10.47,16.38 | X2.4 51.81,33.03 51.81,17.39 v52,17.2 | C7.1 40.38,37.04 v41.26,37.92 | v35.37,37.41 35.5,37.29 v35.5,35.79
+5V  (via drill 0.35)
  Top 0.254: IC3.2 50.52,42.32 C35.1 53.9,43.75 C36.+
  Top 0.406: 50.52,42.32 49.46,41.26 48.96,41.26 48.49,40.79 v46.5,40.79 | v31.93,25.65 U17.8 | v31.93,23.24 32.02,23.33 C37.2 | v44.5,7.52 44.4,7.62 30.15,7.62 29.75,8.02 X6.5 X6.6
  Bottom 0.406: v46.5,40.79 44.5,38.79 v44.5,7.52 | X6.5 31.93,11.22 v31.93,23.24 v31.93,25.65
+12V  (via drill 0.35)
  Top 0.406: C33.1 51.52,46.25 51.55,46.25 | 51.55,46.25 C34.+ 55.2,45.79 | IC3.3 51.55,46.25 | v32.5,53.79 40.73,53.79 IC2.3 42.59,52.94 43.54,53.89 C12.+ 46.28,52.95 C14.1 49.6,52.51
  Top 1.27: v56.82,11.3 44.63,11.3 42.35,9.02 40.75,9.02 X6.1 X6.2 X6.3 | v56.82,52.32 56.2,52.95 C14.1 | v56.82,45.79 56.37,46.25 C34.+ | v56.82,27.69 56.65,27.86 T4.E
  Bottom 0.406: v32.5,53.79 31.12,53.79 IC1.3 30.65,55.93 C32.+ 31.3,57.69 C29.1
  Bottom 1.27: 56.5,53.79 D2.K | 56.5,53.79 56.82,53.47 v56.82,52.32 v56.82,45.79 v56.82,27.69 v56.82,11.3 | C38.+ 56.52,53.82 56.5,53.79
AGND  (via drill 0.35)
  other vias: 32.69,20.32 28.46,12.08 25.03,26.94 28.52,22.5 33.61,16.47 25.94,15.8 22.05,21.3 24.36,28.73 24.93,20.76 31.09,14.76 22.36,4.46 28.97,4.46 33.61,19.26
  pour Top (isolate 0.203): 26.34,11.56 25.96,11.18 25.96,8.89 25.84,8.76 22.66,8.76 21.9,8 21.9,1.27 22.03,1.4 29.27,1.4 29.52,1.65 29.52,8.76 31.04,10.29 31.04,10.67 31.04,13.21 34.22,16.38 34.22,25.91 29.9,30.23 23.68,30.23 20.25,26.8 19.49,26.04 19.49,22.99 23.8,18.67 23.93,18.67 24.18,18.41 24.18,14.1 26.34,11.94
  pour Bottom (isolate 0.203): 26.34,11.56 25.96,11.18 25.96,8.89 25.84,8.76 22.66,8.76 21.9,8 21.9,1.27 22.03,1.4 29.27,1.4 29.52,1.65 29.52,8.76 31.04,10.29 31.04,13.21 34.22,16.38 34.22,25.91 29.9,30.23 23.68,30.23 19.49,26.04 19.49,22.99 23.8,18.67 23.93,18.67 24.18,18.41 24.18,14.1 26.34,11.94
CAN_RX
  Top 0.203: U1.4 22.23,32.69 22.53,32.38 31.5,32.38 32.06,31.82 U2.44
CAN_TX
  Top 0.203: U1.1 18.21,31.95 18.21,31.59 18.36,31.44 21.67,31.44 22.02,31.79 31.5,31.79 31.97,31.32 U2.45
CANH  (via drill 0.35)
  Top 0.203: U1.7 18.5,37.86 v18.5,39.6 | v18.5,44.79 19.73,44.79 R2.1 16.87,44.68 16.17,45.38 14.86,45.38 14.11,44.63 C16.1 13.65,44.79 v3.5,44.79 | v4.25,51.56 12.58,51.56 X8.3
  Bottom 0.203: v18.5,39.6 v18.5,44.79 | U$10.P$4 4,40.79 3.5,40.79 v3.5,44.79 3.5,50.82 v4.25,51.56
CANL  (via drill 0.35)
  Top 0.203: U1.6 20.01,39.13 v20.38,39.5 | v21.39,46.23 21.24,46.38 R2.2 18.06,48.16 14.83,48.16 14.08,47.4 C17.1 8.11,47.4 v7.5,46.79 | v8.5,52.79 12.59,52.79 X8.2
  Bottom 0.203: v20.38,39.5 21.39,40.51 v21.39,46.23 | U$10.P$3 6.53,42.8 7.5,43.77 v7.5,46.79 7.5,51.79 v8.5,52.79
DUPA  (via drill 0.35)
  Top 0.203: S2.1 S2.4 45.14,70.58 C11.1 43.03,73.35 42.22,74.17 26.77,74.17 26.76,74.16 15.16,74.16 v14.53,73.53 | v14.53,67.31 14.76,67.09 U$1.5
  Bottom 0.203: v14.53,73.53 v14.53,67.31
GND  (via drill 0.35)
  Top 0.203: 10.61,19.79 10.69,19.72 11.07,19.72 U3.20 10.61,19.7 10.5,19.81 | 14.39,19.72 14.2,19.72 14.11,19.72 U3.11 14.9,19.7 15.09,19.89 15.7,19.89 v16.5,20.68 | 10.5,19.81 10.5,19.79 | 10.5,19.81 10.5,20.99 10.98,21.46 v11.48,21.46 11.59,21.36 U3.18 | v14.5,21.79 13.46,22.84 C23.2 | U$2.P$2 U$2.P$3 12.59,27.5 11.79,26.69 11.79,25.88 11.94,25.73 13.44,25.73 v13.64,25.53 | C20.2 10.56,26.14 10.48,26.06 10.48,25.79 v10.21,25.53 | v16.5,16.88 16.99,16.88 C21.2
  Top 0.254: v39.3,16 40.07,16 LED9.C
  Top 1.27: v52,3.81 41.74,3.81 X6.9 X6.10
  Bottom 0.203: v11.48,21.46 11.82,21.79 v14.5,21.79 | C7.2 42.09,36.57 41.33,35.81 41.33,35.21 C6.2
  Bottom 0.254: v39.3,16 39.3,8.03 X6.9
  Bottom 1.27: U$3.P$2 52.72,58.69 C38.- 55.05,52.16 55.05,10.41 52,7.37 v52,3.81
  other vias: 40.5,30.81 39.5,29.79 43.74,28.32 37.89,37.88 17.5,29.79 15.5,42.79 15.5,49.79 15.5,52.79 42.34,29.63 37.9,31.12 31.95,30.04 46.15,31.01 41.58,16.13 41.26,6.43 15.48,22.46 10.71,14.78 2.71,11.78 19.34,30.53 18.44,30.09 1.95,24.09 1.95,20.09 1.95,15.09 2.04,9.95 2.01,7.52 10.47,9.5 10.44,6.44 10.54,4.35 39.13,18.11 37.02,18.23 36.53,22.55 42.76,21.47 44.26,45.78 41.47,46.08 45.74,38.52 52.62,44.43 50.98,50.69 43.08,59.71 48.53,64.94 51.26,72.16 54.43,72.75 55.32,71.48 43.51,75.04 11.24,58.41 8.17,58.78 6.14,63.99 6.05,67.12 6.21,72.34 10.94,72.32 10.91,67.58 11.13,64.17 10.79,36.49 10.89,43.26 10.86,46.31 10.32,49.66 18.32,49.92 18.45,52.97 20.21,34.53 15.62,39.28 6.73,37 3.42,37 45.06,5.42 36.68,4.4 40.75,12.02 51.92,12.53 20.19,4.35 17.9,9.93 17.65,5.62 9.71,12.3
  pour Top (isolate 0.203): 20.88,1.4 20.76,1.52 -0.96,1.52 -0.96,78.87 1.58,81.41 57.2,81.41 60.89,77.72 60.89,2.67 58.98,0.76 37.39,0.76 36.12,2.03 36.12,8.13 37.14,9.14 37.14,10.92 39.17,12.95 56.19,12.95 56.7,13.46 56.7,31.75 56.82,31.88 51.36,31.88 49.71,30.23 49.71,28.83 49.84,28.7 44.63,28.7 44.12,28.19 43.49,27.56 43.49,15.88 43.23,15.62 35.23,15.62 34.98,15.88 34.98,26.29 34.6,26.67 30.28,30.99 30.28,31.12 23.42,31.12 23.04,31.12 18.85,26.92 18.85,22.35 21.77,19.43 23.42,17.78 23.42,17.65 23.42,13.59 25.45,11.56 25.45,10.03 25.07,9.65 21.52,9.65 20.88,9.02
  pour Bottom (isolate 0.203): 20.88,1.4 20.76,1.52 -0.96,1.52 -0.96,78.87 1.58,81.41 57.2,81.41 60.89,77.72 60.89,2.67 58.98,0.76 37.39,0.76 36.12,2.03 36.12,8.13 37.14,9.14 37.14,10.92 39.17,12.95 56.19,12.95 56.7,13.46 56.7,31.75 56.82,31.88 51.36,31.88 49.71,30.23 49.71,28.83 49.84,28.7 44.63,28.7 43.49,27.56 43.49,15.88 43.23,15.62 35.23,15.62 34.98,15.88 34.98,26.29 30.28,30.99 30.28,31.12 23.04,31.12 18.85,26.92 18.85,22.35 23.42,17.78 23.42,13.59 25.45,11.56 25.45,10.03 25.07,9.65 21.52,9.65 20.88,9.02
GND1  (via drill 0.35)
  other vias: 47.68,22.48 45.26,21.82 49.92,26.17 53.81,22.09 52.81,15.09 51.81,15.09 46.05,15.35 51.14,22.97
  pour Top (isolate 0.203): 30.15,6.6 30.15,1.78 35.23,1.78 35.49,2.03 35.49,8.64 35.36,8.76 36.63,10.03 36.63,12.7 37.14,13.21 37.52,13.59 55.43,13.59 55.68,13.84 55.68,31.12 51.49,31.12 50.47,30.1 50.47,28.57 49.97,28.07 44.76,28.07 44.51,27.81 44.51,15.11 43.87,14.48 35.11,14.48 31.68,11.05 31.68,9.02 30.15,7.49
  pour Bottom (isolate 0.203): 30.15,7.49 30.15,1.78 35.23,1.78 35.49,2.03 35.49,8.64 35.36,8.76 36.63,10.03 36.63,12.7 37.52,13.59 55.43,13.59 55.68,13.84 55.68,31.12 51.49,31.12 50.47,30.1 50.47,28.57 49.97,28.07 44.76,28.07 44.51,27.81 44.51,15.11 43.87,14.48 35.11,14.48 31.68,11.05 31.68,9.02
IGN_TEST  (via drill 0.35)
  Top 0.203: R5.1 46.88,21.77 T1.C 45.49,23.16 44.36,23.16 44.15,23.37 v37.52,23.37 | v37.5,29.79 37.32,29.61 U2.53
  Bottom 0.203: v37.52,23.37 37.5,23.39 v37.5,29.79
IGNITION  (via drill 0.35)
  Top 0.203: R25.1 45.41,27.3 v43.62,27.3 | v43.5,24 37.21,24 36.65,23.44 35.69,23.44 v35.23,22.99 | v35.49,34.88 35.05,35.32 U2.37
  Bottom 0.203: v43.62,27.3 43.62,24.12 v43.5,24 | v35.23,22.99 35.23,33.49 35.28,33.53 35.28,34.68 v35.49,34.88
KEY_IN  (via drill 0.35)
  Top 0.406: 48.9,13.79 v48.82,13.97 50.35,13.97 50.87,14.5 R12.1
  Top 1.27: v31.42,1.78 v42.85,1.78 | v42.85,13.97 v48.82,13.97 | v48.82,23.24 49.71,23.24 Q2.3
  Bottom 1.27: X6.12 31.12,2.08 v31.42,1.78 | v42.85,1.78 v42.85,13.97 | v48.82,13.97 48.82,21.97 48.85,22 48.85,22.96 48.82,22.98 v48.82,23.24
KEY_OUT  (via drill 0.35)
  Top 0.406: v32.95,14.73 33.46,15.24 44.89,15.24 45.37,15.73 R3.1
  Bottom 0.406: X6.4 32.95,9.5 v32.95,14.73
  Bottom 1.27: X6.4 32.5,8.84 33.96,7.37 33.96,6.29 X6.11
KEY_TEST  (via drill 0.35)
  Top 0.203: 52.88,22.57 T2.C 52.58,23.41 R21.1 52.31,24.67 43.27,24.67 42.99,24.38 v36.25,24.38 | v36.59,30.09 36.59,29.8 36.25,29.46 36.25,27.94 U2.51
  Bottom 0.203: v36.25,24.38 36.59,24.73 v36.59,30.09
MPU_CS  (via drill 0.35)
  Top 0.203: U3.22 10.39,18.9 v9.5,19.79 | v28.25,37.46 33.23,37.46 U2.33 | v14.28,40.23 28.15,40.23 v28.25,40.13
  Bottom 0.203: v9.5,19.79 9.5,37.23 12.27,40 13.54,40 13.77,40.23 v14.28,40.23 | v28.25,37.46 v28.25,40.13
MPU_INT  (via drill 0.35)
  Top 0.203: U3.12 14.84,20.79 v15.5,20.79 | v17.5,23.79 31.59,23.79 31.93,24.13 33.84,24.13 34.98,25.27 39.42,25.27 39.82,25.66 U2.58
  Bottom 0.203: v15.5,20.79 17.5,22.79 v17.5,23.79
MPU_MISO  (via drill 0.35)
  Top 0.203: U3.9 v15.5,18.9 16.61,18.9 17.5,19.79 v19.5,19.79 | v20.5,29.79 21.5,30.79 v28.5,30.79 | v29.09,35.79 29.62,36.32 U2.35 | X5.2 12.79,11.6 13.52,12.32 v15.55,12.32
  Bottom 0.203: v19.5,19.79 20.5,20.79 v20.5,29.79 | v28.5,30.79 29.09,31.38 v29.09,35.79 | v15.55,12.32 15.55,18.85 v15.5,18.9
MPU_MOSI  (via drill 0.35)
  Top 0.203: U3.24 8.24,18.1 v7.55,18.8 | v8.5,41.67 v30.91,41.67 | U2.36 33.27,35.73 32.51,35.73 32.21,35.43 v30.75,35.43 | X5.3 6.33,13.34 6.66,13.34 8.12,14.79 v9.5,14.79
  Bottom 0.203: v8.5,41.67 7.55,40.84 v7.55,18.8 7.55,17.91 9.13,16.33 9.13,15.16 v9.5,14.79 | v30.91,41.67 v30.75,35.43
MPU_SCLK  (via drill 0.35)
  Top 0.203: U3.23 9.24,18.5 v8.56,19.18 | v10.5,40.92 v28.98,40.92 | v28.98,36.79 30.53,36.82 U2.34 | X5.4 3.49,14.1 v2.85,14.73 | v3.5,31.79 v8.56,31.79
  Bottom 0.203: v8.56,19.18 v8.56,31.79 8.56,38.86 v10.5,40.92 | v28.98,40.92 v28.98,36.79 | v2.85,14.73 2.85,29.22 3.16,29.53 3.16,31.45 v3.5,31.79
MS56_CS  (via drill 0.35)
  Top 0.203: U$2.P$4 U$2.P$5 21.52,26.29 v23.04,27.81 | v23.12,44.58 41.07,44.58 v41.33,44.32 | U2.20 41.37,39.32 41.37,40.08 41.84,40.55 v41.84,40.77
  Bottom 0.203: v41.33,44.32 41.84,43.81 v41.84,40.77 | v23.04,27.81 23.04,42.16 22.79,42.42 22.79,44.25 v23.12,44.58
MS56_MISO  (via drill 0.35)
  Top 0.203: U$2.P$6 v17.5,27.54 21.16,27.54 v22.41,28.79 | v22.97,46.3 39.6,46.3 v39.81,46.1 | v40.17,41.42 40.17,40.18 40.22,40.13 40.22,39.37 U2.22 | X4.3 6.36,20.51 6.68,20.51 10.34,24.16 16.76,24.16 17.3,24.7 v17.45,24.7
  Bottom 0.203: v39.81,46.1 39.81,41.78 v40.17,41.42 | v22.97,46.3 22.41,45.74 v22.41,28.79 | v17.45,24.7 17.5,24.75 v17.5,27.54
MS56_MOSI  (via drill 0.35)
  Top 0.203: U$2.P$7 v18.5,28.79 21.51,28.79 22.57,29.85 28.63,29.85 v29.77,30.99 | v30.5,45.67 38.46,45.67 v38.92,45.22 | v39.5,40.79 39.81,40.48 39.81,40.03 39.82,40.03 U2.23 | v8.5,13.84 v17.72,13.84
  Bottom 0.203: v29.77,30.99 29.77,44.94 v30.5,45.67 | v38.92,45.22 39.45,44.68 39.45,41.64 39.5,41.59 v39.5,40.79 | X4.2 6.36,18.27 6.68,18.27 8.5,16.46 v8.5,13.84 | v17.72,13.84 18.5,14.62 v18.5,28.79
MS56_SCLK  (via drill 0.35)
  Top 0.203: U$2.P$8 15.74,30.04 v16.5,30.79 | v16.85,43.56 40.44,43.56 v40.82,43.18 | v40.93,40.89 40.93,40.15 40.91,40.13 40.91,39.37 U2.21 | X4.4 9.39,24.79 v16.5,24.79
  Bottom 0.203: 16.5,40.79 v16.5,30.79 v16.5,24.79 | 16.5,40.79 16.5,41.21 | v40.82,43.18 40.82,41 v40.93,40.89 | 16.5,40.79 16.5,43.21 v16.85,43.56
N$1
  Top 0.203: U3.10 14.12,19.33 15.03,19.33 15.24,19.53 16.54,19.53 C22.1 17.69,20.98
N$2
  Top 0.203: 36.22,39.37 U2.30 36.22,39.37 | C2.1 34.94,40.16 35.06,40.28 36.07,40.28 36.22,40.13 36.22,39.37
N$3  (via drill 0.35)
  Top 0.203: R9.2 v25.96,18.25 C26.2 | C25.1 v25.96,20.07 24.23,20.07 v23.5,20.79 | v23.42,26.29 24.72,26.29 U17.1
  Bottom 0.203: v23.5,20.79 23.5,26.21 v23.42,26.29 | v25.96,18.25 v25.96,20.07
N$4  (via drill 0.35)
  Top 0.203: 29.4,18.67 R8.2 v31.04,18.25 C27.1 | U17.4 26.38,20.82 28.65,20.82 C25.2 v30.92,20.07
  Bottom 0.203: v31.04,18.25 31.04,19.94 v30.92,20.07
N$5
  Top 0.203: R4.2 R3.2 45.55,18.44 T1.B
N$6  (via drill 0.35)
  Top 0.203: U2.1 43.19,29.82 v42.22,30.79
  Bottom 0.203: C3.1 42.22,31.98 v42.22,30.79
N$7
  Top 0.203: R14.1 45.7,66.76 LED1.A
N$8  (via drill 0.35)
  Top 0.203: v47.5,32.79 46.5,31.79 44.8,31.79 U2.5
  Bottom 0.203: v47.5,32.79 47.39,32.69 Q1.3 47.52,31.13 46.63,30.24 C8.2
N$9  (via drill 0.35)
  Top 0.203: U2.6 44.83,32.38 46.41,32.38 46.87,32.84 46.87,33.06 47.61,33.79 v49.5,33.79
  Bottom 0.203: C9.2 49.48,35.97 Q1.1 49.79,34.09 v49.5,33.79
N$10
  Top 0.203: R10.1 25.04,22.8 U17.3
N$11
  Top 0.203: R15.2 LED2.A
N$12
  Top 0.203: T2.B 50.87,19.31 R12.2 50.93,18.09 R13.2
N$13  (via drill 0.35)  (1 unrouted)
  Top 0.203: 22.58,16.47 22.51,16.4 | 22.58,16.47 R6.2 | X6.7 24.27,10.46 24.06,10.67 v22.03,10.67 | v22.03,15.24 22.03,15.91 22.58,16.47
  Bottom 0.203: 22.53,15.24 22.51,15.24 | v22.03,10.67 v22.03,15.24
N$14  (via drill 0.35)
  Top 0.203: 20.23,16.53 20.12,16.42 | 20.23,16.53 R7.2 | X6.8 20.22,9.04 v20.12,9.14 | v20.12,15.24 20.12,16.42 | 20.12,16.42 20.23,16.53
  Bottom 0.203: 19.99,15.11 v20.12,15.24 v20.12,9.14
N$15
  Top 0.203: R10.2 25.04,24.7 U17.2
N$16  (via drill 0.35)
  Top 0.203: U17.7 30.7,24.79 v33.5,24.79 | v33.46,27.18 33.29,27.34 R11.1
  Bottom 0.203: v33.5,24.79 33.46,24.84 v33.46,27.18
N$17
  Bottom 1.27: U$3.P$1 55.24,61.59 D2.A
N$18
  Top 0.203: U$1.6 39.53,65.09 40.21,65.77 42.91,65.77 R14.2
N$19
  Top 0.203: R15.1 42.13,65.09 U$1.15
N$20
  Top 0.203: LED4.C 49.67,18.61 R5.2
N$21
  Top 0.203: R21.2 54.92,24.14 LED3.C
N$26  (via drill 3.1)  (2 unrouted)
  other vias: 4.67,2.92 55.38,76.06 4.67,76.06
N$27  (via drill 3.1)
  other vias: 55.38,2.92
N$28
  Top 0.254: R1.1 LED6.A
N$29  (via drill 0.35)
  Top 0.203: R20.2 42.09,19.13 v42.09,19.3 | U2.60 40.91,27.97 40.91,28.73 41.33,29.15 v41.33,29.34
  Bottom 0.203: v42.09,19.3 42.09,28.57 v41.33,29.34
N$30  (via drill 0.35)
  Top 0.203: R27.2 36.56,21.26 37.77,22.48 37.92,22.48 v38.03,22.59 | v38.16,26.54 38.32,26.71 U2.55
  Bottom 0.203: v38.03,22.59 38.03,22.98 38.15,23.11 v38.15,26.54 v38.16,26.54
N$31
  Top 0.203: Q2.1 R22.2
N$32  (via drill 0.35)
  Top 0.203: R23.2 47.47,25.54 R22.1 49.19,27.41 v49.97,28.19 | v49.97,29.72 51.81,29.72 51.83,29.7 52.13,29.7 52.15,29.72 53.44,29.72 T4.C
  Bottom 0.203: v49.97,28.19 v49.97,29.72
N$33  (via drill 0.35)
  Top 0.203: R28.2 38.25,21.67 v38.94,22.36 | v39.04,25.91 39.04,26.84 39.22,27.02 39.22,27.78 U2.57
  Bottom 0.203: v38.94,22.36 38.94,25.8 v39.04,25.91
N$34  (via drill 0.35)
  Top 0.203: 40.32,21.39 R29.2 40.06,21.52 v40.06,22.61 | U2.59 40.41,27.78 40.41,27.02 40.82,26.61 v40.82,25.27
  Bottom 0.203: v40.82,25.27 40.06,24.51 v40.06,22.61
N$35
  Top 0.203: R24.2 45.69,26.29 46.92,26.29 47.2,26.58 47.2,27.4 R25.2 48.76,28.96 52.25,28.96 52.83,28.38 T4.B
N$36
  Top 0.203: R27.1 35.81,19.51 LED7.A
N$37
  Top 0.203: R28.1 38.14,19.48 LED8.A
N$38
  Top 0.203: R29.1 40.48,19.53 LED9.A
NRST  (via drill 0.35)
  Top 0.203: v2.47,61.21 17.65,61.21 18.21,61.77 v21.01,61.77 47.53,61.77 v48.5,60.79 | v46.24,33.15 45.91,32.82 U2.7 | C10.1 29.37,51.14 S1.1 S1.4 21.55,51.14 v21.01,51.69 | X1.2 2.8,26.09 v2.15,26.74
  Bottom 0.203: 2.27,61.02 1.89,60.64 | 2.27,61.02 v2.47,61.21 | v48.5,60.79 48.5,39.79 46.44,37.73 46.44,34.79 46.24,34.59 v46.24,33.15 | v21.01,51.69 v21.01,61.77 | v2.15,26.74 2.15,29.28 1.89,29.53 1.89,60.64 | 1.89,60.64 2.27,61.02
SDIO_CK  (via drill 0.35)
  Top 0.203: v27.11,39.24 30.86,39.24 32.58,40.96 35.68,40.96 35.74,41.02 36.13,40.63 36.72,40.63 37.22,40.13 37.22,39.54 37.32,39.45 U2.28
  Bottom 0.203: J1.5 26.64,39.71 v27.11,39.24
SDIO_CMD  (via drill 0.35)
  Top 0.203: U2.54 37.72,27.78 37.72,27.02 36.99,26.29 v27.87,26.29
  Bottom 0.203: J1.3 26.79,37.51 27.87,36.43 27.87,30.53 | 27.87,30.53 | 27.87,30.53 v27.87,26.29
SDIO_D0  (via drill 0.35)
  Top 0.203: v24.06,34.42 33.27,34.42 U2.39
  Bottom 0.203: J1.7 24.81,41.92 24.2,41.92 24.05,41.77 24.05,35.36 24.06,35.35 v24.06,34.42
SDIO_D1  (via drill 0.35)
  Top 0.203: v38.28,42.93 v27.23,42.93 | v38.41,41.02 38.41,39.37 U2.26
  Bottom 0.203: v27.23,42.93 26.5,42.93 26.41,43.02 25.8,43.02 J1.8 | v38.28,42.93 38.41,42.8 v38.41,41.02
SDIO_D2  (via drill 0.35)
  Top 0.203: v25.5,33.78 v31.3,33.78 | v31.82,41.79 37.26,41.79 37.65,41.4 37.65,40.2 37.72,40.13 37.72,39.37 U2.27
  Bottom 0.203: v31.3,33.78 31.82,34.31 v31.82,41.79 | v25.5,33.78 25.5,35.24 J1.1
SDIO_D3  (via drill 0.35)
  Top 0.203: v25.71,28.19 33.74,28.19 35.06,26.87 36.57,26.87 36.72,27.02 36.72,27.78 U2.52
  Bottom 0.203: v25.71,28.19 25.71,30.12 26.34,30.75 26.46,30.75 27.11,31.39 27.11,35.81 26.51,36.41 J1.2
SERVO2_PWM  (via drill 0.35)
  Top 0.203: 38.91,20.35 38.94,20.32 | 39.04,20.32 38.94,20.32 | 39.04,20.32 v41.46,20.32 | R6.1 23.72,19.31 31.06,19.31 31.43,19.69 32.96,19.69 33.61,20.35 38.91,20.35 | v41.46,26.29 41.32,26.43 U2.61 | 38.91,20.35 38.94,20.32 | 38.94,20.32 39.04,20.32
  Bottom 0.203: v41.46,20.32 v41.46,26.29
SERVO3_PWM  (via drill 0.35)
  Top 0.203: R7.1 21.25,18.25 22.06,17.45 35.2,17.45 35.39,17.26 40.98,17.26 41.2,17.48 43.65,17.48 43.8,17.63 43.8,18.84 43.5,19.13 v43.5,19.79 | U2.62 41.91,27.78 41.91,27.02 42.06,26.87 42.45,26.87 v42.72,26.59
  Bottom 0.203: v43.5,19.79 43.5,23.11 42.87,23.74 42.87,26.45 v42.72,26.59
SWCLK  (via drill 0.35)
  Top 0.203: U2.49 34.97,28.23 v34.6,28.23 | v34.47,13.21 8.56,13.21 v7.93,12.57 | v3.61,27.3 5.86,27.3 X1.3 | v3.5,8.41 7.64,8.41 v7.67,8.38
  Bottom 0.203: v34.6,28.23 34.6,13.34 v34.47,13.21 | v7.93,12.57 7.93,8.64 v7.67,8.38 | v3.5,8.41 3.5,26.96 v3.61,27.3
SWDIO  (via drill 0.35)
  Top 0.203: v4.36,15.75 16.71,15.75 18.1,14.35 29.64,14.35 v30.15,14.35 | U2.46 33.28,30.73 31.42,30.73 31.42,30.72 v30.5,29.79
  Bottom 0.203: v30.5,29.79 30.15,29.45 v30.15,14.35 | 4.5,15.89 v4.36,15.75 4.36,27.38 5.08,28.1 5.4,28.1 X1.4
TENSO_ADC  (via drill 0.35)
  Top 0.203: C28.1 R11.2 35.26,29.04 35.61,29.4 35.61,30.35 36.14,30.87 v36.14,30.92 | v36.12,33.27 44.72,33.27 U2.8
  Bottom 0.203: v36.14,30.92 36.12,30.93 v36.12,33.27
TENSO_IN+  (via drill 0.35)
  Top 0.203: v27.87,14.99 29.39,14.99 29.65,15.24 29.65,16.37 R8.1
  Bottom 0.203: X6.14 25.64,12.76 v27.87,14.99
TENSO_IN-  (via drill 0.35)
  Top 0.203: v23.42,15.11 26.73,15.11 27.15,15.54 R9.1
  Bottom 0.203: X6.15 23.15,14.84 v23.42,15.11
UART_RX
  Top 0.203: X2.2 51.75,36.46 51.42,36.46 48.6,39.27 U2.17
UART_TX
  Top 0.203: U2.16 47.97,37.32 50.5,34.79 52.16,34.79 X2.3
XBEE_RX  (via drill 0.35)
  Top 0.203: U2.43 33.27,32.42 32.51,32.42 31.78,33.15 24.43,33.15 23.16,34.42 v21.78,34.42 | v21.5,72.79 21.21,73.09 U$1.2
  Bottom 0.203: v21.78,34.42 21.78,45.72 22.02,45.97 22.02,72.27 v21.5,72.79
XBEE_TX  (via drill 0.35)
  Top 0.203: v34.65,33.79 34.37,33.52 34.37,33.07 34.13,32.82 U2.42 | v34.22,71.12 16.19,71.12 U$1.3
  Bottom 0.203: v34.65,33.79 34.65,56.08 34.5,56.23 34.5,70.84 v34.22,71.12
XBEE_VDD  (via drill 0.35)
  Top 0.254: v26.5,74.79 16.45,74.79 U$1.1
  Bottom 0.254: IC1.2 28.34,56.92 C30.1 28.55,60.09 C13.+ 28.34,72.96 v26.5,74.79

### Text on the board
tPlace: Barduś | Hybrid lower pcb vol2